# Altium project Powerjack_LED.PrjPcb
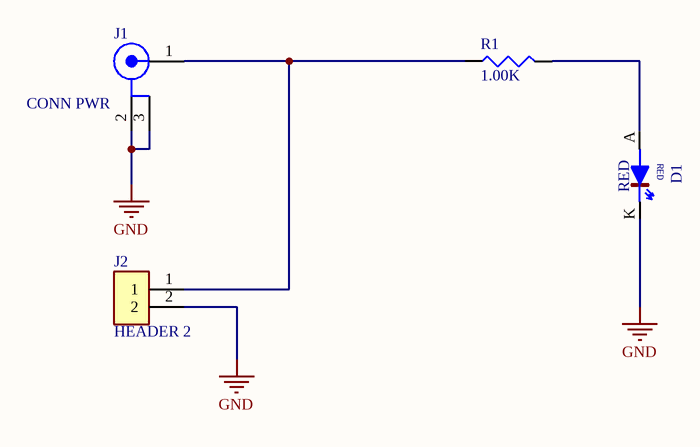
[diagram p0: Powerjack_LED.SchDoc]
1 sheet, 4 parts. Net scope: global (net labels, ports and power ports of the same name join across sheets).
Board files: Powerjack_LED.PcbDoc, Powerjack_LED_panel.PcbDoc

## Sheet Powerjack_LED.SchDoc: Powerjack_LED
size Letter; Date: 20200406; Author: FLE; CompanyName: Spectrum Techniques LLC.; DrawnBy: FLE; Engineer: FLE; Organization: Spectrum Techniques, LLC; Address1: 106 Union Valley Road; Address2: Oak Ridge, TN 37830; Address3: www.spectrumtechniques.com; Revision: V0.0.1; SheetNumber: 1; SheetTotal: 1

### Parts
D1  RED  [LED-0805-RED]
J1  CONN PWR  [EJ508A]
J2  HEADER 2  [TSW-102-07-G-S]
R1  1.00K  [0805-R]

### Nets
GND: D1.K J1.2(SHIELD) J1.3(SHIELD) J2.2
NetD1_A: D1.A R1.2
NetJ1_1: J1.1(CENTER) J2.1 R1.1

### Notes on the sheet
- Title
- Size:
- Date:
- Letter
- Number:
- Time:
- Revision:
- Sheet
- of
- File:

### Library data of the parts
D1 = LTST-C191KRKT: LED RED CLEAR 0805 SMD; Z9_MFR PN: LTST-C171KRKT; Z9_MFR: Lite-On; MANUFACTURER: LITE-On Inc.; Z9_VENDOR: Digi-Key; Z9_PRICE: 0.1183; Z9_VENDOR PN: 160-1427-1-ND; A0_Text Field1: S03; BoardName: HV/COUNTER; ST P#: LSMRED; ClassName: LEDS; COST (CT): 0.1183; COST: 0.1183; DISTRIBUTOR # (CT): 160-1427-1-ND; DISTRIBUTOR #: 160-1427-1-ND; DISTRIBUTOR: Digi-Key; MANUFACTURER #: LTST-C171KRKT; Part_Number: LTST-C171KRKT
J1 = CONN - BNC-EJ508A: CONN PWR JACK 2.1X5.5MM SOLDER; MANUFACTURER: MPD (Memory Protection Devices); Z9_MFR: MPD; A0_Text Field1: Y10; COST (CT): 0.8944; Z9_PRICE: 0.7143; Z9_VENDOR: Digi-Key; Z9_VENDOR PN: EJ508A-ND; BoardName: COMM; ST P#: EC033; COST: 0.8944; DISTRIBUTOR # (CT): EJ508A-ND; DISTRIBUTOR #: EJ508A-ND; MANUFACTURER #: EJ508A; DISTRIBUTOR: Digi-Key; Part_Number: EJ508A; Z9_MFR PN: EJ508A; HAND PLACED: HAND PLACED
J2 = TSW-102-07-G-S: CONN HEADER 2POS .100" SGL GOLD; Z9_MFR: Samtec; MANUFACTURER: Samtec Inc.; Z9_PRICE: 0.685; Z9_VENDOR: Digi-Key; A0_Text Field1: Y08; COST (CT): 0.6312; BoardName: HV/COUNTER; ST P#: EJ002; Z9_MFR PN: TSW-102-07-G-S; ClassName: Room_U8; COST: 0.6312; DISTRIBUTOR # (CT): SAM1029-02-ND; DISTRIBUTOR #: SAM1029-02-ND; DISTRIBUTOR: Digi-Key; MANUFACTURER #: TSW-102-07-G-S; Part_Number: TSW-102-07-G-S; Applications: -; HAND PLACED: HAND PLACED
R1 = RES 1.00K 1P0 0805: RES SMD 1K OHM 1% 1/8W 0805; Z9_MFR: Yageo; Z9_MFR PN: RC0805FR-071KL; Z9_PRICE: 0.0088; A0_Text Field1: B10; Z9_VENDOR: Digi-Key; Z9_VENDOR PN: 311-1.00KCRCT-ND; BoardName: HV/COUNTER; ST P#: ASM1001; COST (CT): 0.0088; COST: 0.0088; DISTRIBUTOR # (CT): 311-1.00KCRCT-ND; DISTRIBUTOR #: 311-1.00KCRCT-ND; DISTRIBUTOR: Digi-Key; MANUFACTURER #: RC0805FR-071KL; MANUFACTURER: Yageo; Part_Number: RC0805FR-071KL